# EAGLE design Bluetooth Low Energy Circuit (EAGLE 9.6.2)
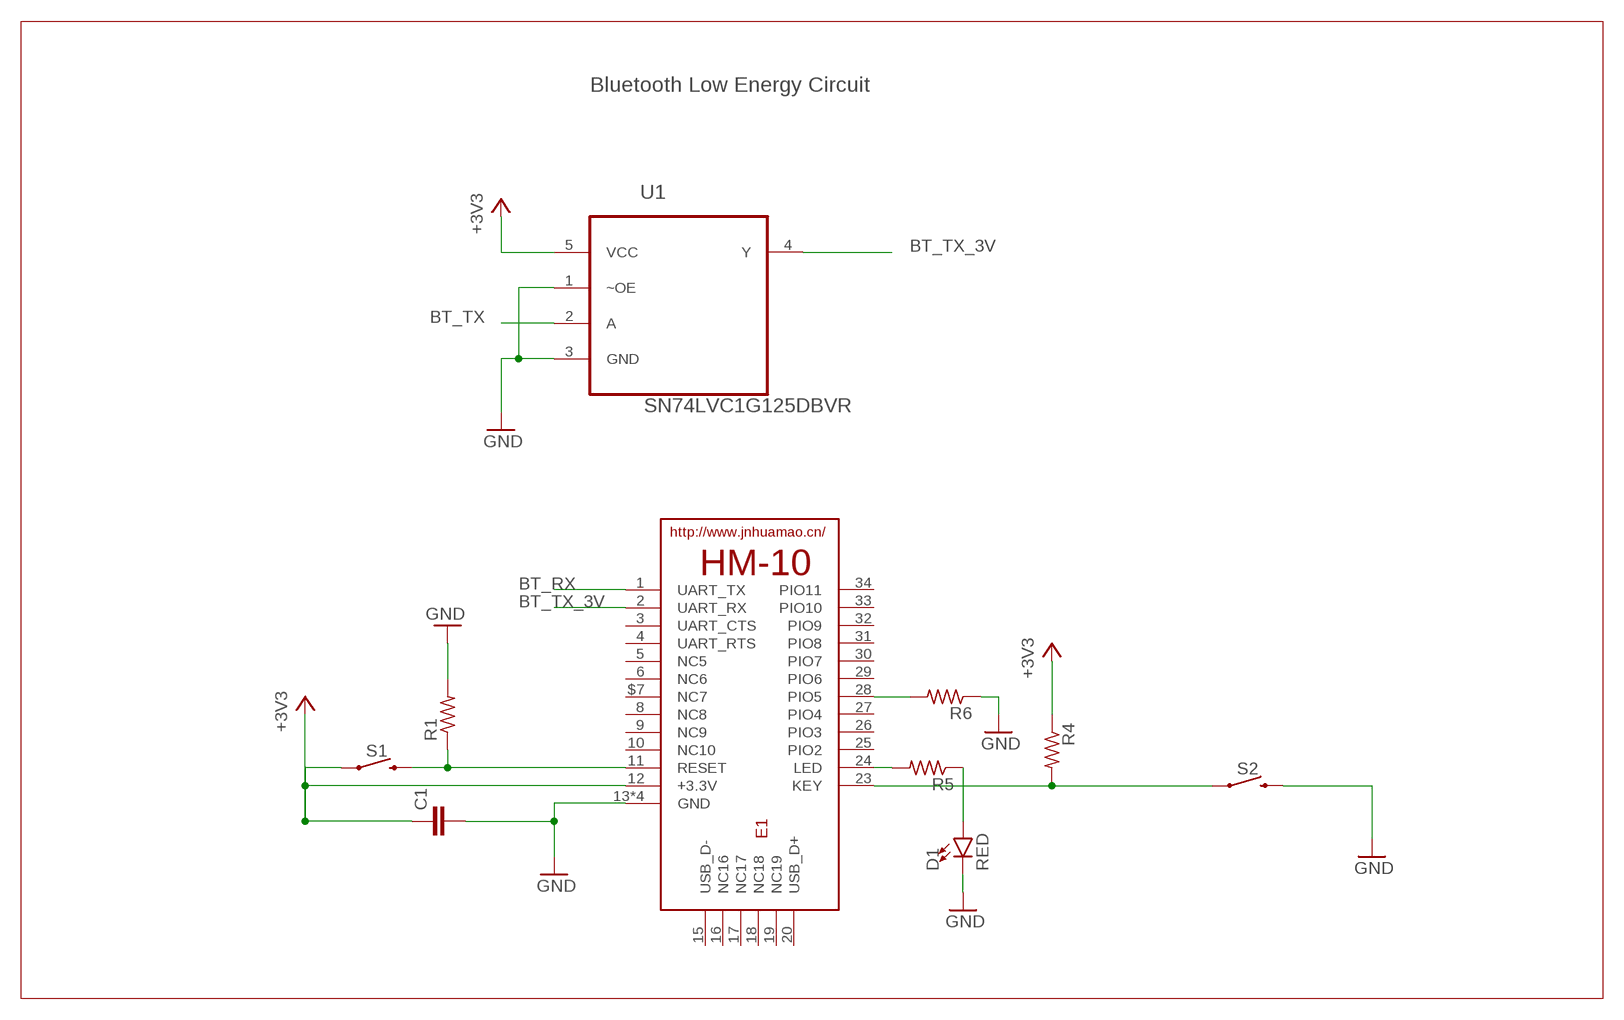
[diagram p0: schematic, sheet 1]

## Parts
C1  C-EUC0805  [C0805]
D1  RED  LED-RED0603  [LED-0603]
E1  HM-10-BOARD  [26.9X13X2.2_BOARD]
R1  R-US_R0805  [R0805]
R4  R-US_R0805  [R0805]
R5  R-US_R0805  [R0805]
R6  R-US_R0805  [R0805]
S1  MOMENTARY-SWITCH-SPST-SMD-6.0X3.5MM  [TACTILE_SWITCH_SMD_6.0X3.5MM]
S2  MOMENTARY-SWITCH-SPST-SMD-6.0X3.5MM  [TACTILE_SWITCH_SMD_6.0X3.5MM]
U1  SN74LVC1G125DBVR  [SOT95P280X145-5N]

## Nets
+3V3: C1.1 E1.12(+3.3V) R4.1 S1.1 U1.5(VCC)
BT_RX: E1.1(UART_TX)
BT_TX: U1.2(A)
BT_TX_3V: E1.2(UART_RX) U1.4(Y)
GND: C1.2 D1.C E1.13(GND) E1.14(GND) E1.21(GND) E1.22(GND) R1.2 R6.1 S2.2 U1.1(~OE) U1.3(GND)
N$1: E1.11(RESET) R1.1 S1.2
N$2: E1.23(KEY) R4.2 S2.1
N$3: E1.24(LED) R5.2
N$4: E1.28(PIO5) R6.2
N$5: D1.A R5.1
Unconnected: E1.3(UART_CTS) E1.4(UART_RTS) E1.5(NC5) E1.6(NC6) E1.8(NC8) E1.9(NC9) E1.10(NC10) E1.15(USB_D-) E1.16(NC16) E1.17(NC17) E1.18(NC18) E1.19(NC19) E1.20(USB_D+) E1.25(PIO2) E1.26(PIO3) E1.27(PIO4) E1.29(PIO6) E1.30(PIO7) E1.31(PIO8) E1.32(PIO9) E1.33(PIO10) E1.34(PIO11) E1.$7(NC7)

## Notes on the sheet
- Bluetooth Low Energy Circuit

## Library data of the parts
C1 = rcl:C-EU: CAPACITOR, European symbol; SPICEPREFIX: C
D1 = SparkFun-LED:LED-RED: Red SMD LED Used in manufacturing of most products at SparkFun Packages: 0603 - SMD 0603 package [Product Link] <http://docs.avagotech.com/docs/AV02-0551EN> 0603 SMART - SMD 0603 SMART package ( more efficient and expensive)[Product Link] <http://www.osram-os.com/Graphics/XPic2/00077099_0.pdf> 1206 - SMD1206 package [Product Link] <https://www.sparkfun.com/datasheets/DevTools/LilyPad/Q150OVS4.pdff> SparkFun Products: Pro Mini 328 -5V <https://www.sparkfun.com/products/821> RedBoard <https://www.sparkfun.com/products/12757> IOIO-OTG <https://www.sparkfun.com/products/13613>; PROD_ID: DIO-00819
E1 = PC_BLE_HM10:HM-10: HM Bluetooth module use TI CC2540 or CC2541, Master and slave roles in one, transmission version and remote control version and PIO state acquisition functions in one, Support the AT command modify module parameters, Convenient and flexible.
R1 R4-R6 = rcl:R-US_: RESISTOR, American symbol; SPICEPREFIX: R
S1 S2 = SparkFun-Switches:MOMENTARY-SWITCH-SPST: Momentary Switch (Pushbutton) - SPST Normally-open (NO) SPST momentary switches (buttons, pushbuttons). Variants PTH-12MM - 12mm square, through-hole Momentary Pushbutton Switch - 12mm Square <https://www.sparkfun.com/products/9190> (COM-09190) PTH-6.0MM, PTH-6.0MM-KIT - 6.0mm square, through-hole Mini Pushbutton Switch <https://www.sparkfun.com/products/97> (COM-00097) KIT package intended for soldering kit's - only one side of pads' copper is exposed. PTH-RIGHT-ANGLE-KIT - Right-angle, through-hole Right Angle Tactile Button <https://www.sparkfun.com/products/10791> - Used on SparkFun BigTime Watch Kit <https://www.sparkfun.com/products/11734> SMD-12MM - 12mm square, surface-mount Tactile Button - SMD (12mm) <https://www.sparkfun.com/products/12993> (COM-12993) Used on SparkFun PicoBoard <https://www.sparkfun.com/products/11888> SMD-4.5MM - 4.5mm Square Trackball Switch Used on SparkFun Blackberry Trackballer Breakout <https://www.sparkfun.com/products/13169> SMD-4.6MMX2.8MM - 4.60mm x 2.80mm, surface mount Used on SparkFun Pro Micro - RP2040 <https://www.sparkfun.com/products/17717> SMD-5.2MM, SMD-5.2-REDUNDANT - 5.2mm square, surface-mount Mini Pushbutton Switch - SMD <https://www.sparkfun.com/products/8720> (COM-08720) Used on Arduino Pro Mini <https://www.sparkfun.com/products/11114> REDUNDANT package connects both switch circuits together SMD-6.0X3.5MM - 6.0 x 3.5mm, surface mount Momentary Reset Switch SMD <https://www.sparkfun.com/products/8229> (COM-08229) SMD-6.2MM-TALL - 6.2mm square, surface mount Tactile Button - SMD (6mm) <https://www.sparkfun.com/products/12992> Used on SparkFun Digital Sandbox <https://www.sparkfun.com/products/12651> SMD-RIGHT-ANGLE - Right-angle, surface mount Used on SparkFun Block for Intel® Edison - Arduino <https://www.sparkfun.com/products/13036>; PROD_ID: SWCH-14278; SF_SKU: COM-08229
U1 = PC_IC_SN74LVC1G125DBVR:SN74LVC1G125DBVR: SINGLE BUS BUFFER GATE WITH 3-STATE OUTPUT; AVAILABILITY: Unavailable; DESCRIPTION: Buffer/Line Driver 1-CH Non-Inverting 3-ST CMOS Medical 5-Pin SOT-23 T/R; MF: Texas Instruments; MP: SN74LVC1G125DBVR; PACKAGE: SOT-23-5 Texas Instruments; PRICE: None

## Board
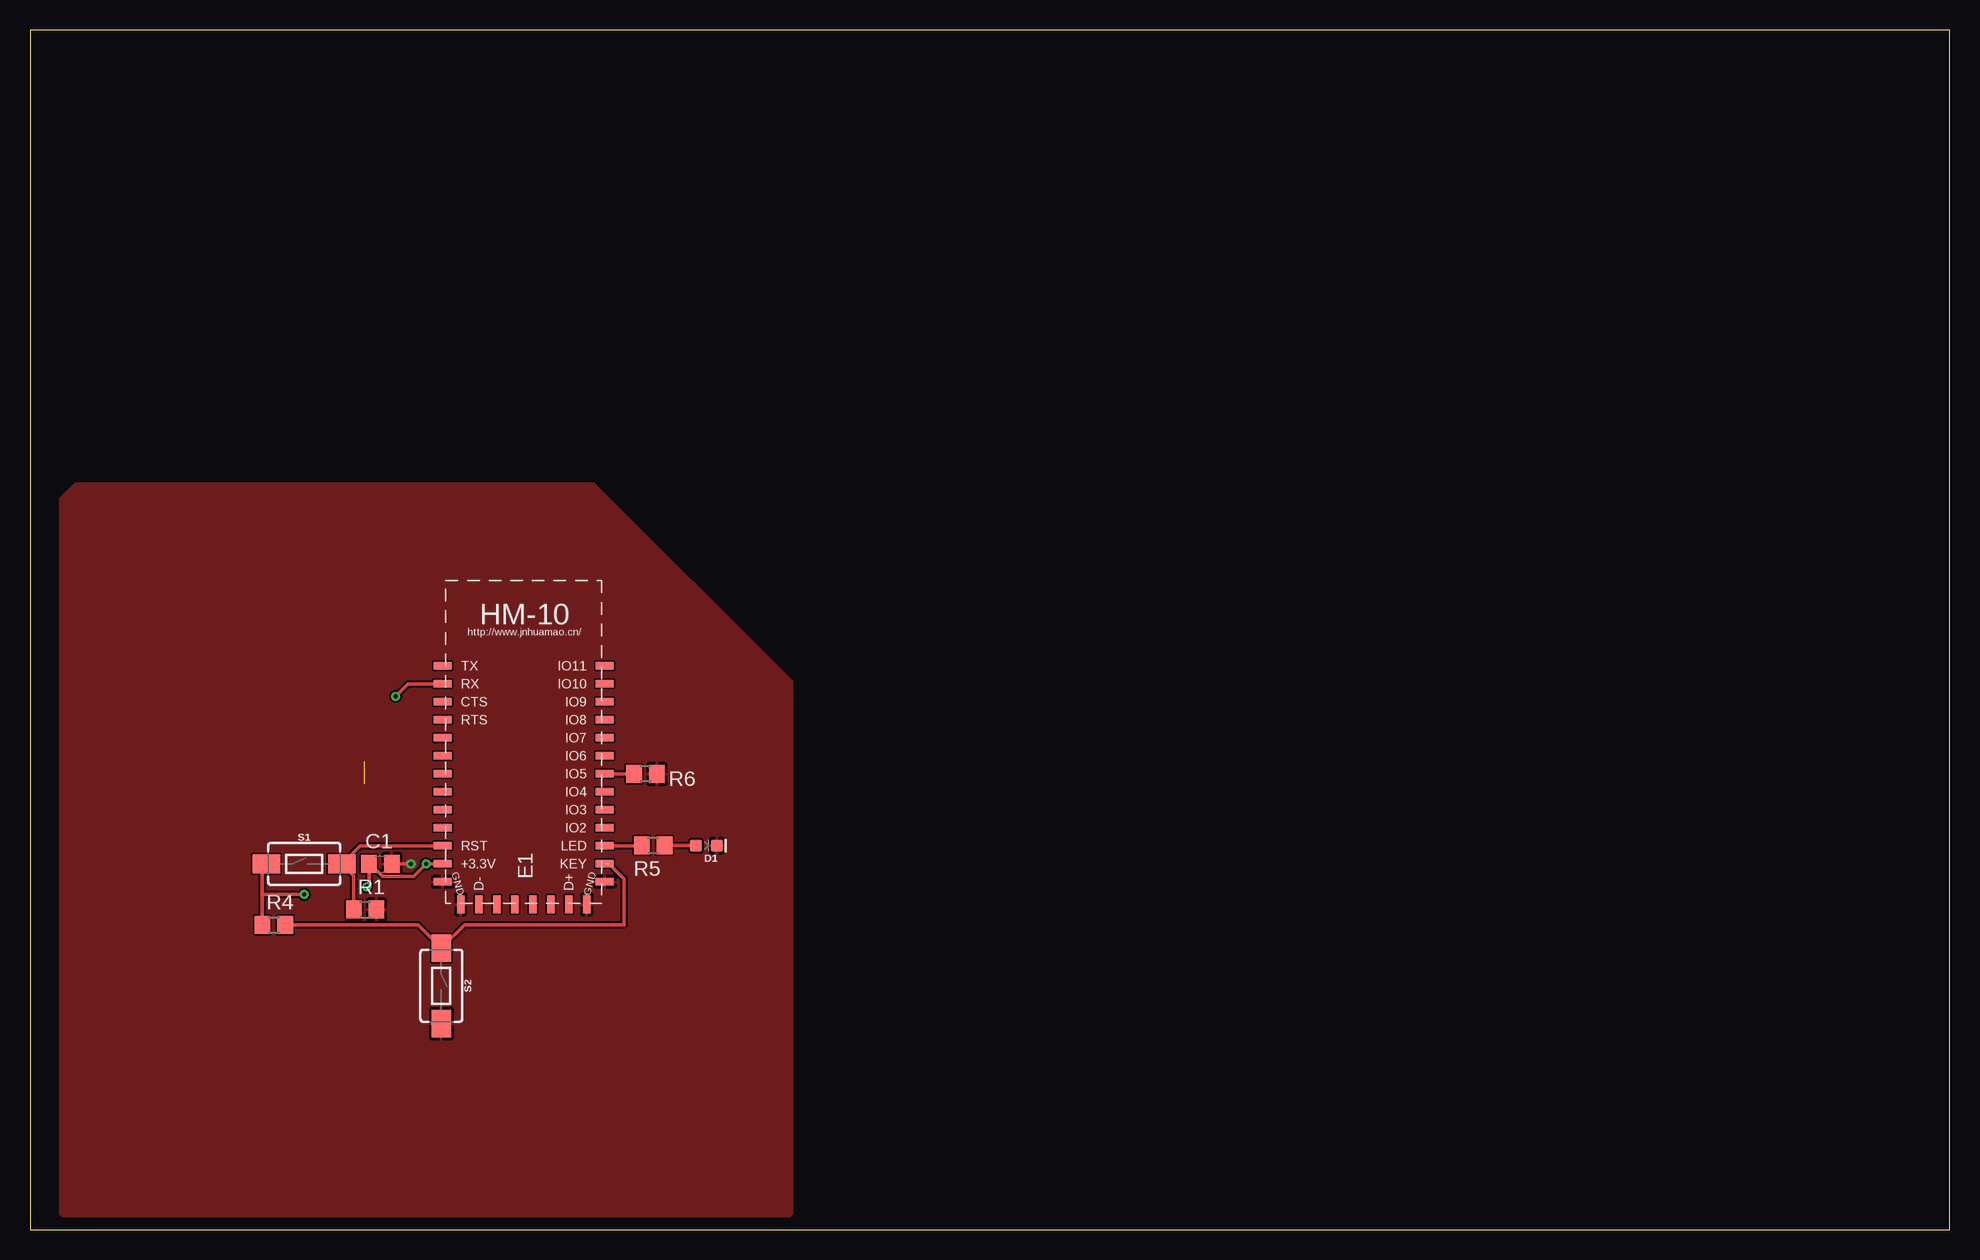
[diagram p1: board, top side]
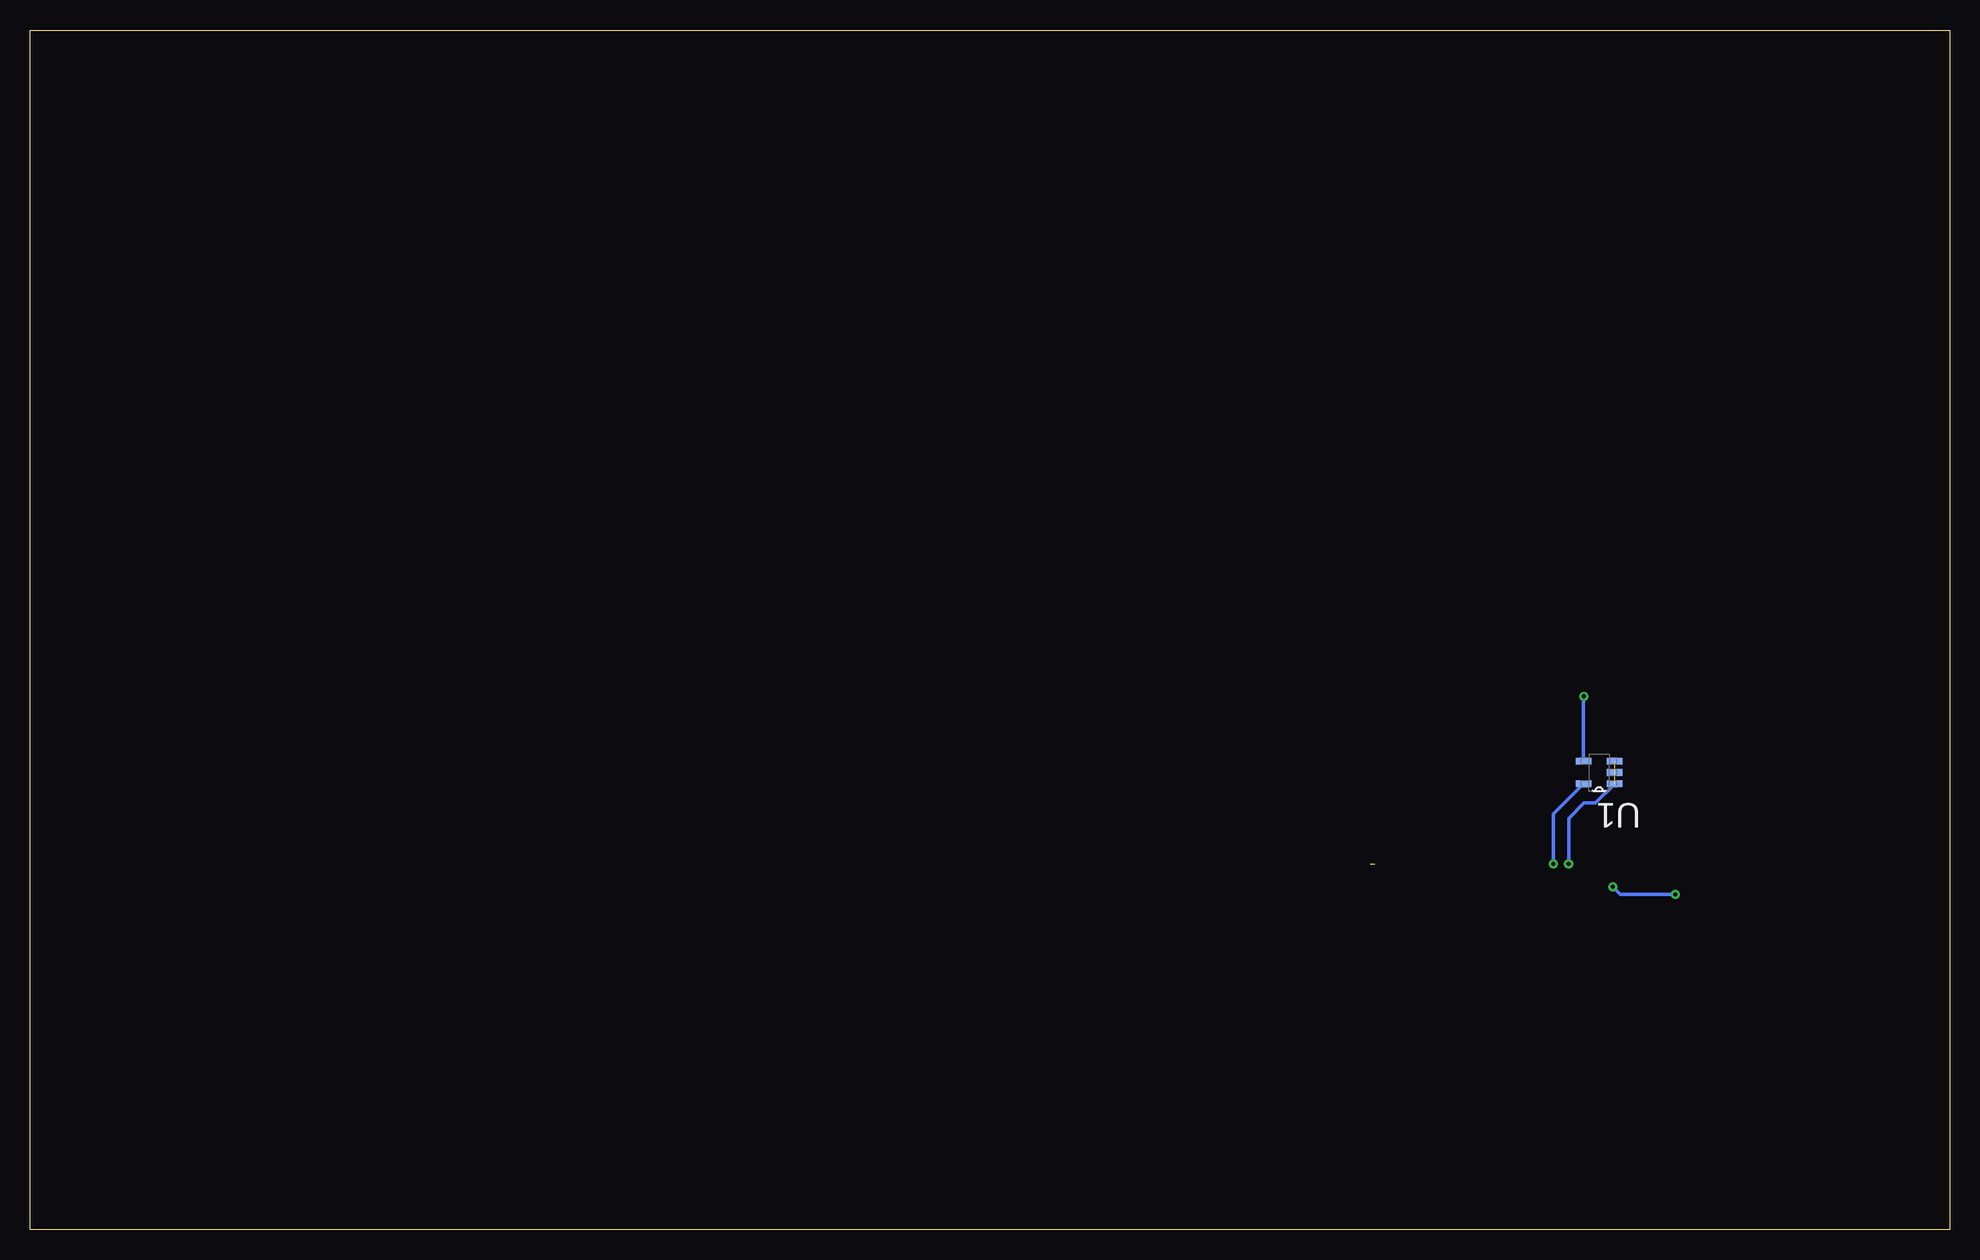
[diagram p2: board, bottom side, seen from below]

Size 160 x 100 mm. Coordinates in mm from the lower left corner, seen from the top.
Outline: 0,0 160,0 160,100 0,100 0,0
Copper layers (1*16): Top 0.035mm / dielectric 1.5mm / Bottom 0.035mm
Design rules "default": minimum track width 6mil, minimum drill 0.35mm, track to track 6mil, track to pad 6mil, pad to pad 6mil, via to via 6mil, smd to smd 6mil, copper to edge 40mil, drill to drill 6mil, minimum pad ring 10mil, minimum via ring 8mil, stop-mask expansion 4mil, vias tented up to drill 0mil, thermal gap 10mil

### Footprints (pad centres in the part's own frame; a part is rotated, then mirrored left to right if it is on the bottom)
C0805 = smd 1.3 x 1.5: 1 -0.95,0; 2 0.95,0
LED-0603 = smd 1 x 1: A -0.877,0; C 0.877,0
26.9X13X2.2_BOARD = smd 1.5 x 0.635: 1 -7.5,0; 2 -7.5,-1.5; 3 -7.5,-3; 4 -7.5,-4.5; 5 -7.5,-6; 6 -7.5,-7.5; 8 -7.5,-10.5; 9 -7.5,-12; 10 -7.5,-13.5; 11 -7.5,-15; 12 -7.5,-16.5; 13 -7.5,-18; 22 6,-18; 23 6,-16.5; 24 6,-15; 25 6,-13.5; 26 6,-12; 27 6,-10.5; 28 6,-9; 29 6,-7.5; 30 6,-6; 31 6,-4.5; 32 6,-3; 33 6,-1.5; 34 6,0; $7 -7.5,-9 | smd 0.635 x 1.5: 14 -6,-19.875; 15 -4.5,-19.875; 16 -3,-19.875; 17 -1.5,-19.875; 18 0,-19.875; 19 1.5,-19.875; 20 3,-19.875; 21 4.5,-19.875
R0805 = smd 1.3 x 1.5: 1 -0.95,0; 2 0.95,0
TACTILE_SWITCH_SMD_6.0X3.5MM = smd 2.3 x 1.6: 1 -3.15,0; 2 3.15,0
SOT95P280X145-5N = smd 1.27 x 0.559: 1 -1.295,0.94; 2 -1.295,0; 3 -1.295,-0.94; 4 1.295,-0.94; 5 1.295,0.94

### Placement (x,y rotation side)
C1  29.21,30.48 0 top
D1  56.39,32 0 top
E1  41.91,46.99 0 top
R1  27.94,26.67 0 top
R4  20.32,25.4 0 top
R5  51.94,32 180 top
R6  51.31,37.97 180 top
S1  22.86,30.48 0 top
S2  34.29,20.32 270 top
U1  29.21,38.1 180 bottom

### Tracks (layer width: path | path; a pad name or v marks a point on that pad's centre or on a via)
+3V3  (via drill 0.35)
  Top 0.305: E1.12 v33.03,30.49 v33.02,30.48 31.96,29.43 29.38,29.43 28.33,30.48 C1.1 28.26,28.77 v28.07,28.57 | S1.1 19.37,30.14 19.37,27.94 | 19.37,27.94 R4.1 | v22.86,27.94 19.37,27.94
  Bottom 0.305: U1.5 33.02,34.65 v33.02,30.48 | v28.07,28.57 27.43,27.94 v22.86,27.94
BT_TX_3V  (via drill 0.35)
  Top 0.305: v30.48,44.45 31.52,45.49 E1.2
  Bottom 0.305: U1.4 30.5,44.42 v30.48,44.45
GND  (via drill 0.35)  (1 unrouted)
  Top 0.305: v31.75,30.48 C1.2
  Bottom 0.305: U1.1 29.52,35.56 30.48,35.56 31.75,34.29 v31.75,30.48
  pour Top: 6.35,62.23 46.99,62.23 63.5,45.72 63.5,1.27 62.23,0 3.81,0 2.54,1.27 2.54,60.96 3.81,62.23
N$1
  Top 0.305: R1.1 26.99,29.5 S1.2 27.52,31.99 E1.11
N$2  (1 unrouted)
  Top 0.305: R4.2 32.36,25.4 S2.1 36.22,25.4 49.53,25.4 49.53,29.21 48.26,30.48
N$3
  Top 0.305: R5.2 50.98,31.99 E1.24
N$4
  Top 0.305: R6.2 47.93,37.97 E1.28
N$5
  Top 0.305: D1.A R5.1